# Altium schematic sheet Architecture_V2.SchDoc: System Architecture
size 420 x 297 mm; SheetNumber: 1; SheetTotal: 6; DOC_NO_SCH_DWG: 1
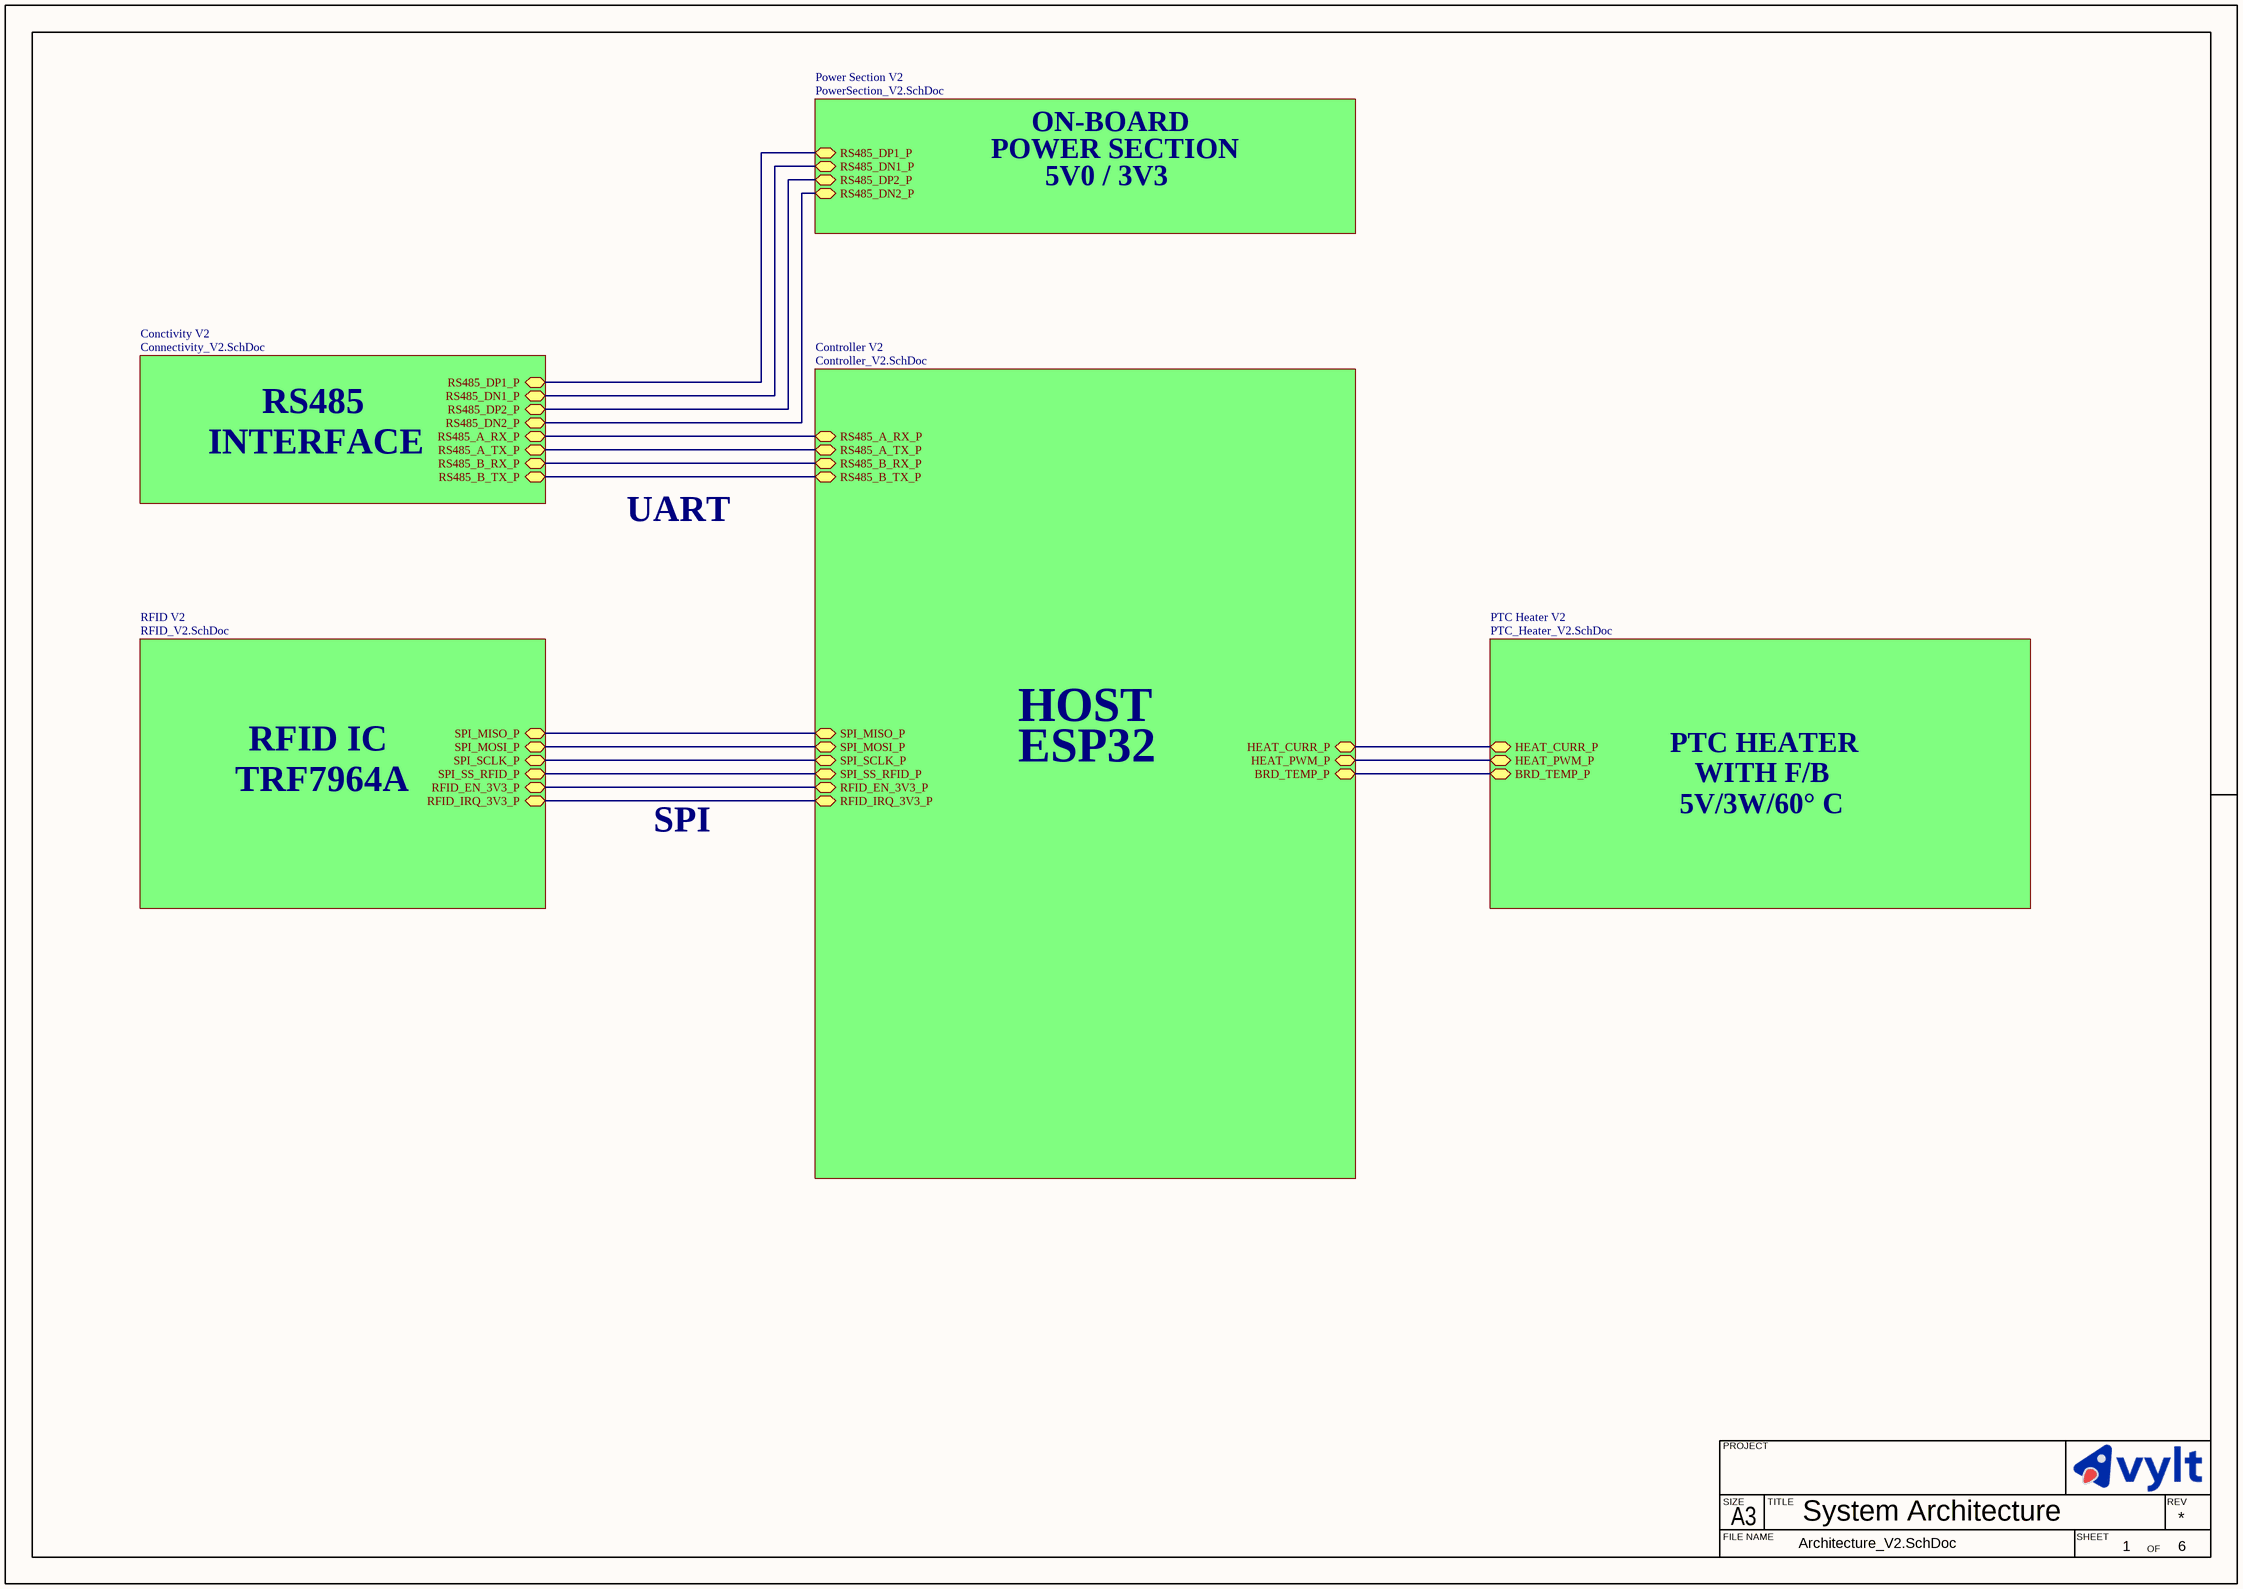
[diagram p0: Architecture_V2.SchDoc]

## Sub-sheets
Conctivity V2 = Connectivity_V2.SchDoc: RS485_A_TX_P (bidir), RS485_A_RX_P (bidir), RS485_DP1_P (bidir), RS485_DN1_P (bidir), RS485_B_TX_P (bidir), RS485_B_RX_P (bidir), RS485_DP2_P (bidir), RS485_DN2_P (bidir)
Controller V2 = Controller_V2.SchDoc: SPI_MOSI_P (bidir), SPI_SCLK_P (bidir), SPI_SS_RFID_P (bidir), RFID_EN_3V3_P (bidir), RFID_IRQ_3V3_P (bidir), RS485_A_TX_P (bidir), RS485_A_RX_P (bidir), SPI_MISO_P (bidir), HEAT_CURR_P (bidir), BRD_TEMP_P (bidir), HEAT_PWM_P (bidir), RS485_B_TX_P (bidir), RS485_B_RX_P (bidir)
Power Section V2 = PowerSection_V2.SchDoc: RS485_DP1_P (bidir), RS485_DN1_P (bidir), RS485_DP2_P (bidir), RS485_DN2_P (bidir)
PTC Heater V2 = PTC_Heater_V2.SchDoc: HEAT_CURR_P (bidir), BRD_TEMP_P (bidir), HEAT_PWM_P (bidir)
RFID V2 = RFID_V2.SchDoc: SPI_MISO_P (bidir), SPI_MOSI_P (bidir), SPI_SCLK_P (bidir), SPI_SS_RFID_P (bidir), RFID_EN_3V3_P (bidir), RFID_IRQ_3V3_P (bidir)

## Nets
(unnamed): sheet RFID V2/SPI_MISO_P, sheet Controller V2/SPI_MISO_P
(unnamed): sheet RFID V2/SPI_MOSI_P, sheet Controller V2/SPI_MOSI_P
(unnamed): sheet RFID V2/SPI_SCLK_P, sheet Controller V2/SPI_SCLK_P
(unnamed): sheet RFID V2/SPI_SS_RFID_P, sheet Controller V2/SPI_SS_RFID_P
(unnamed): sheet RFID V2/RFID_EN_3V3_P, sheet Controller V2/RFID_EN_3V3_P
(unnamed): sheet RFID V2/RFID_IRQ_3V3_P, sheet Controller V2/RFID_IRQ_3V3_P
(unnamed): sheet Controller V2/RS485_A_TX_P, sheet Conctivity V2/RS485_A_TX_P
(unnamed): sheet Controller V2/RS485_A_RX_P, sheet Conctivity V2/RS485_A_RX_P
(unnamed): sheet Controller V2/HEAT_CURR_P, sheet PTC Heater V2/HEAT_CURR_P
(unnamed): sheet Controller V2/BRD_TEMP_P, sheet PTC Heater V2/BRD_TEMP_P
(unnamed): sheet Controller V2/HEAT_PWM_P, sheet PTC Heater V2/HEAT_PWM_P
(unnamed): sheet Controller V2/RS485_B_TX_P, sheet Conctivity V2/RS485_B_TX_P
(unnamed): sheet Controller V2/RS485_B_RX_P, sheet Conctivity V2/RS485_B_RX_P
(unnamed): sheet Conctivity V2/RS485_DP1_P, sheet Power Section V2/RS485_DP1_P
(unnamed): sheet Conctivity V2/RS485_DN1_P, sheet Power Section V2/RS485_DN1_P
(unnamed): sheet Conctivity V2/RS485_DP2_P, sheet Power Section V2/RS485_DP2_P
(unnamed): sheet Conctivity V2/RS485_DN2_P, sheet Power Section V2/RS485_DN2_P

## Notes on the sheet
- POWER SECTION
- ON-BOARD
- 5V0 / 3V3
- INTERFACE
- RS485
- UART
- HOST
- TRF7964A
- RFID IC
- ESP32
- PTC HEATER
- WITH F/B
- SPI
- 5V/3W/60° C
- PROJECT
- SIZE
- FILE NAME
- A3
- TITLE
- SHEET
- OF
- REV